# Altium project HAB-Communications-Board.PrjPcb
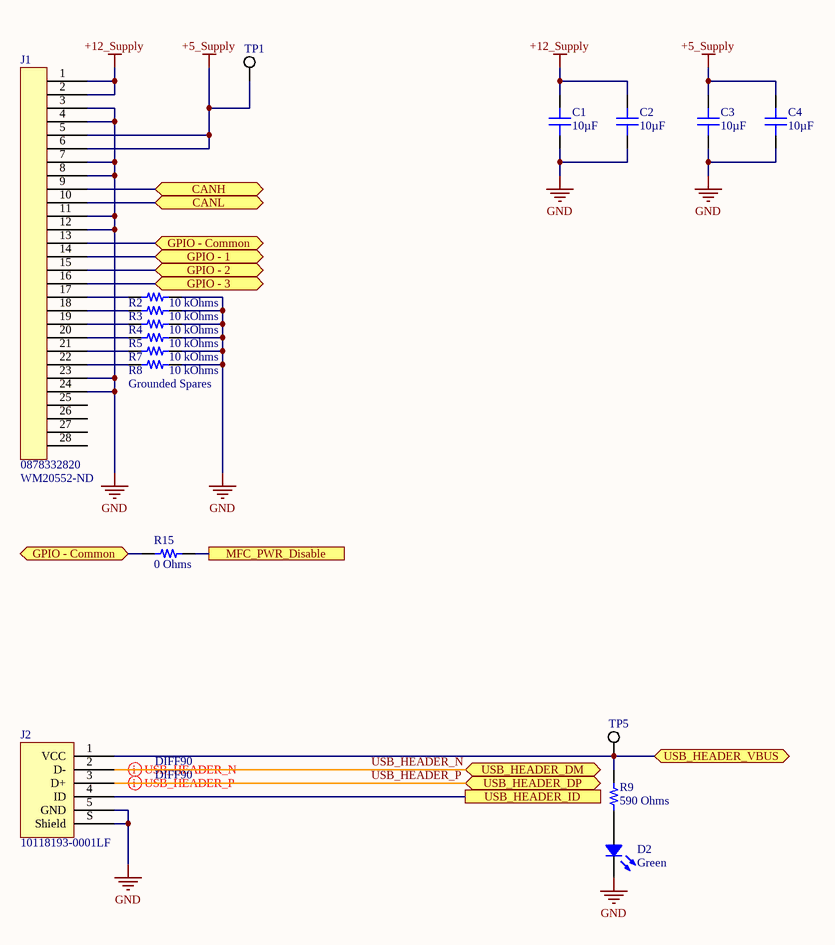
[diagram p0: Interfaces.SchDoc]
5 sheets, 87 parts. Net scope: flat (ports and power ports of the same name join across sheets).
Board file: HAB-Communications-Board.PcbDoc
Sheets:
  Interfaces.SchDoc
  Microcontroller.SchDoc
  Power-Supplies.SchDoc
  Transceivers.SchDoc
  Transmitters.SchDoc

## Sheet Interfaces.SchDoc: Communications Card Interfaces
size A3; Revision: 1A; SheetNumber: 1; SheetTotal: 5; Organization: Brickworks; Address1: Matthew Glazer; Address2: Design Engineer

### Parts
C1  10µF  [CAP 0805_2012]
C2  10µF  [CAP 0805_2012]
C3  10µF  [CAP 0805_2012]
C4  10µF  [CAP 0805_2012]
D2  Green  [LED 0603_1608 GREEN]
J1  0878332820  Supplier Part Number 1: WM20552-ND  [0878332820]
J2  10118193-0001LF  [FCI USB 10118193-0001LF]
R2  10 kOhms  [RES 0603_1608]
R3  10 kOhms  [RES 0603_1608]
R4  10 kOhms  [RES 0603_1608]
R5  10 kOhms  [RES 0603_1608]
R7  10 kOhms  [RES 0603_1608]
R8  10 kOhms  [RES 0603_1608]
R9  590 Ohms  [RES 0603_1608]
R15  0 Ohms  [RES 0603_1608]
TP1  5019  [KSTN-5019_V]  (value not drawn)
TP5  5019  [KSTN-5019_V]  (value not drawn)

### Ports
CANH (bidir), CANL (bidir), GPIO - 1 (bidir), GPIO - 2 (bidir), GPIO - 3 (bidir), GPIO - Common (bidir), MFC_PWR_Disable, USB_HEADER_DM (bidir), USB_HEADER_DP (bidir), USB_HEADER_ID, USB_HEADER_VBUS (bidir)

### Nets
+5_Supply: C3.2 C4.2 J1.5 J1.6 TP1.1
+12_Supply: C1.2 C2.2 J1.1 J1.2
GND: C1.1 C2.1 C3.1 C4.1 D2.2 J1.3 J1.4 J1.7 J1.8 J1.11 J1.12 J1.23 J1.24 J2.5(GND) J2.S(Shield) R2.2 R3.2 R4.2 R5.2 R7.2 R8.2
USB_HEADER_N: J2.2(D-) ; port USB_HEADER_DM
USB_HEADER_P: J2.3(D+) ; port USB_HEADER_DP
NetD2_1: D2.1 R9.1
NetD4_1: J1.10 ; port CANL
NetD4_2: J1.9 ; port CANH
NetJ1_13: J1.13 R15.1 ; port GPIO - Common
NetJ1_14: J1.14 ; port GPIO - 1
NetJ1_15: J1.15 ; port GPIO - 2
NetJ1_16: J1.16 ; port GPIO - 3
NetJ1_17: J1.17 R2.1
NetJ1_18: J1.18 R3.1
NetJ1_19: J1.19 R4.1
NetJ1_20: J1.20 R5.1
NetJ1_21: J1.21 R7.1
NetJ1_22: J1.22 R8.1
NetJ2_1: J2.1(VCC) R9.2 TP5.1 ; port USB_HEADER_VBUS
NetJ2_4: J2.4(ID) ; port USB_HEADER_ID
NetR15_2: R15.2 ; port MFC_PWR_Disable

Not connected (* = marked no-connect by the designer): J1 25 26 27 28

### Layout directives
differential pair; differential pair class DIFF90: USB_HEADER_N, USB_HEADER_P

### Notes on the sheet
- (near R8) Grounded Spares
- Title
- Size:
- Date:
- A3
- Number:
- Time:
- Revision:
- Sheet
- of
- File:

### Library data of the parts
C1-C4 = CC0805KKX5R7BB106: CAP CER 10UF 16V X5R 0805; Manufacturer: Yageo; Tolerance: ±10%; Part Number: CC0805KKX5R7BB106; Value: 10µF; Applications: General Purpose; Capacitance: 10µF; ComponentLink1Description: Datasheet; ComponentLink1URL: https://www.yageo.com/upload/media/product/productsearch/datasheet/mlcc/UPY-GPHC_X5R_4V-to-50V_25.pdf; ComponentLink2Description: DigiKey Link; ComponentLink2URL: http://digikey.com/product-detail/en/yageo/CC0805KKX5R7BB106/311-1865-1-ND/5195767; Device Package: 0805 (2012 Metric); LastUpdated: 9/2/2020 1:04:30 AM; Lifecycle Status: Active; Minimum Order: 1; Mounting Type: Surface Mount, MLCC; Operating Temperature: -55°C ~ 85°C; Package / Case: 0805 (2012 Metric); Packaging: TapeAndReel; PartId: 8867; Part Status: Active; Price: 0.09; Series: CC; Size / Dimension: 0.079" L x 0.049" W (2.00mm x 1.25mm); Supplier 1: DigiKey; Supplier Part Number 1: 311-1865-1-ND; Temperature Coefficient: X5R; Thickness (Max): 0.057" (1.45mm); Voltage - Rated: 16V
D2 = LTST-C193KGKT-5A: LED GREEN CLEAR CHIP SMD; Manufacturer: Lite-On Inc.; Configuration: Standard; Current - Test: 5mA; Lens Color: Colorless; Lens Size: 1.15mm x 0.80mm; Lens Style: Rectangle with Flat Top; Millicandela Rating: 16.25mcd; Viewing Angle: 130°; Voltage - Forward (Vf) (Typ): 2V; Wavelength - Dominant: 572nm; Wavelength - Peak: 574nm; Part Number: LTST-C193KGKT-5A; Color: Green; ComponentLink1Description: Datasheet; ComponentLink1URL: http://optoelectronics.liteon.com/upload/download/DS22-2007-0094/LTST-C193KGKT-5A.PDF; ComponentLink2Description: DigiKey Link; ComponentLink2URL: http://digikey.com/product-detail/en/lite-on-inc/LTST-C193KGKT-5A/160-1828-1-ND/2356247; Device Package: 0603 (1608 Metric); Height (Max): 0.45mm; LastUpdated: 9/2/2020 1:20:41 AM; Lens Transparency: Clear; Lifecycle Status: Active; Minimum Order: 1; Mounting Type: Surface Mount; Package / Case: 0603 (1608 Metric); Packaging: TapeAndReel; PartId: 694; Part Status: Active; Price: 0.06; Series: -; Size / Dimension: 1.60mm L x 0.80mm W; Supplier 1: DigiKey; Supplier Part Number 1: 160-1828-1-ND; Supplier Device Package: Chip LED; Value: Green
J2 = 10118193-0001LF: CONN RCPT USB2.0 MICRO B SMD R/A; Manufacturer: Amphenol ICC (FCI); Connector Type: USB - micro B; Current Rating (Amps): 1.8A per Contact; Gender: Receptacle; Mating Cycles: 10000; Number of Contacts: 5; Number of Ports: 1; Shielding: Shielded; Voltage - Rated: 100VAC; Part Number: 10118193-0001LF; ComponentLink1Description: Datasheet; ComponentLink1URL: https://cdn.amphenol-icc.com/media/wysiwyg/files/documentation/datasheet/inputoutput/io_usb_micro.pdf; ComponentLink2Description: DigiKey Link; ComponentLink2URL: //digikey.com/product-detail/en/amphenol-icc-fci/10118193-0001LF/609-4616-2-ND/2785388; Features: Solder Retention; LastUpdated: 12/9/2019 8:51:28 PM; Lifecycle Status: 0; Minimum Order: 1; Mounting Feature: Horizontal; Mounting Type: Surface Mount, Right Angle; Through Hole; Operating Temperature: -30°C ~ 80°C; Packaging: TapeAndReel; Part Status: Active; Price: 0.21; Series: -; Specifications: USB 2.0; Supplier 1: DigiKey; Supplier Part Number 1: 609-4616-2-ND; Termination: Solder
R2-R5 R7 R8 = RMCF0603JT10K0: RES 10K OHM 5% 1/10W 0603; Manufacturer: Stackpole Electronics Inc; Power (Watts): 0.1W, 1/10W; Temperature Coefficient: ±200ppm/°C; Part Number: RMCF0603JT10K0; Value: 10 kOhms; ComponentLink1Description: Datasheet; ComponentLink1URL: https://www.seielect.com/catalog/sei-packaging.pdf; ComponentLink2Description: DigiKey Link; ComponentLink2URL: http://digikey.com/product-detail/en/stackpole-electronics-inc/RMCF0603JT10K0/RMCF0603JT10K0CT-ND/1943191; Composition: Thick Film; Device Package: 0603 (1608 Metric); Features: Automotive AEC-Q200; Height - Seated (Max): 0.022" (0.55mm); LastUpdated: 8/30/2020 8:48:45 PM; Lifecycle Status: Active; Minimum Order: 1; Number of Terminations: 2; Operating Temperature: -55°C ~ 155°C; Package / Case: 0603 (1608 Metric); Packaging: CutTape; PartId: 25659; Part Status: Active; Price: 0.10; Ratings: AEC-Q200; Resistance: 10 kOhms; Series: RMCF; Size / Dimension: 0.061" L x 0.031" W (1.55mm x 0.80mm); Supplier 1: DigiKey; Supplier Part Number 1: RMCF0603JT10K0CT-ND; Supplier Device Package: 0603; Tolerance: ±5%
R9 = RMCF0603FT590R: RES 590 OHM 1% 1/10W 0603; Manufacturer: Stackpole Electronics Inc; Power (Watts): 0.1W, 1/10W; Temperature Coefficient: ±100ppm/°C; Part Number: RMCF0603FT590R; Value: 590 Ohms; ComponentLink1Description: Datasheet; ComponentLink1URL: https://www.seielect.com/catalog/sei-rmcf_rmcp.pdf; ComponentLink2Description: DigiKey Link; ComponentLink2URL: http://digikey.com/product-detail/en/stackpole-electronics-inc/RMCF0603FT590R/RMCF0603FT590RCT-ND/2418096; Composition: Thick Film; Device Package: 0603 (1608 Metric); Features: Automotive AEC-Q200; Height - Seated (Max): 0.022" (0.55mm); LastUpdated: 9/2/2020 1:09:40 AM; Lifecycle Status: Active; Minimum Order: 1; Number of Terminations: 2; Operating Temperature: -55°C ~ 155°C; Package / Case: 0603 (1608 Metric); Packaging: CutTape; PartId: 23847; Part Status: Active; Price: 0.10; Ratings: AEC-Q200; Resistance: 590 Ohms; Series: RMCF; Size / Dimension: 0.061" L x 0.031" W (1.55mm x 0.80mm); Supplier 1: DigiKey; Supplier Part Number 1: RMCF0603FT590RCT-ND; Supplier Device Package: 0603; Tolerance: ±1%
R15 = RMCF0603ZT0R00: RES 0 OHM JUMPER 1/10W 0603; Manufacturer: Stackpole Electronics Inc; Power (Watts): 0.1W, 1/10W; Part Number: RMCF0603ZT0R00; Value: 0 Ohms; ComponentLink1Description: Datasheet; ComponentLink1URL: https://www.seielect.com/catalog/sei-rmcf_rmcp.pdf; ComponentLink2Description: DigiKey Link; ComponentLink2URL: http://digikey.com/product-detail/en/stackpole-electronics-inc/RMCF0603ZT0R00/RMCF0603ZT0R00CT-ND/1943218; Composition: Thick Film; Device Package: 0603 (1608 Metric); Features: Automotive AEC-Q200; Height - Seated (Max): 0.022" (0.55mm); LastUpdated: 9/2/2020 1:09:45 AM; Lifecycle Status: Active; Minimum Order: 1; Number of Terminations: 2; Operating Temperature: -55°C ~ 155°C; Package / Case: 0603 (1608 Metric); Packaging: CutTape; PartId: 22613; Part Status: Active; Price: 0.10; Ratings: AEC-Q200; Resistance: 0 Ohms; Series: RMCF; Size / Dimension: 0.061" L x 0.031" W (1.55mm x 0.80mm); Supplier 1: DigiKey; Supplier Part Number 1: RMCF0603ZT0R00CT-ND; Supplier Device Package: 0603; Tolerance: Jumper
TP1 TP5 = CMP-1672-00008-1: Test Point, 1 Position SMD, RoHS, Tape and Reel; ComponentLink1Description: Manufacturer URL; Package Quantity: 1000; DatasheetVersion: 03/2014; Packaging: Tape and Reel; ComponentLink2URL: http://www.keyelco.com/product-pdf.cfm?p=1357; ComponentLink1URL: http://www.keyelco.com/; Mount: Surface Mount; Contact Plating: Silver; PackageDescription: 1-Pin Surface Mount Device, Body 3.81 x 2.03 mm; Pins: 1; RoHSCompliant: True; Mounting Technology: Surface Mount; ComponentLink2Description: Datasheet; PackageReference: 5019
J1 = 0878332820: Supplier 1: Digi-Key

## Sheet Microcontroller.SchDoc: Communications Card Microcontroller
size A2; Revision: 1A; SheetNumber: 2; SheetTotal: 5; Organization: Brickworks; Address1: Matthew Glazer; Address2: Design Engineer
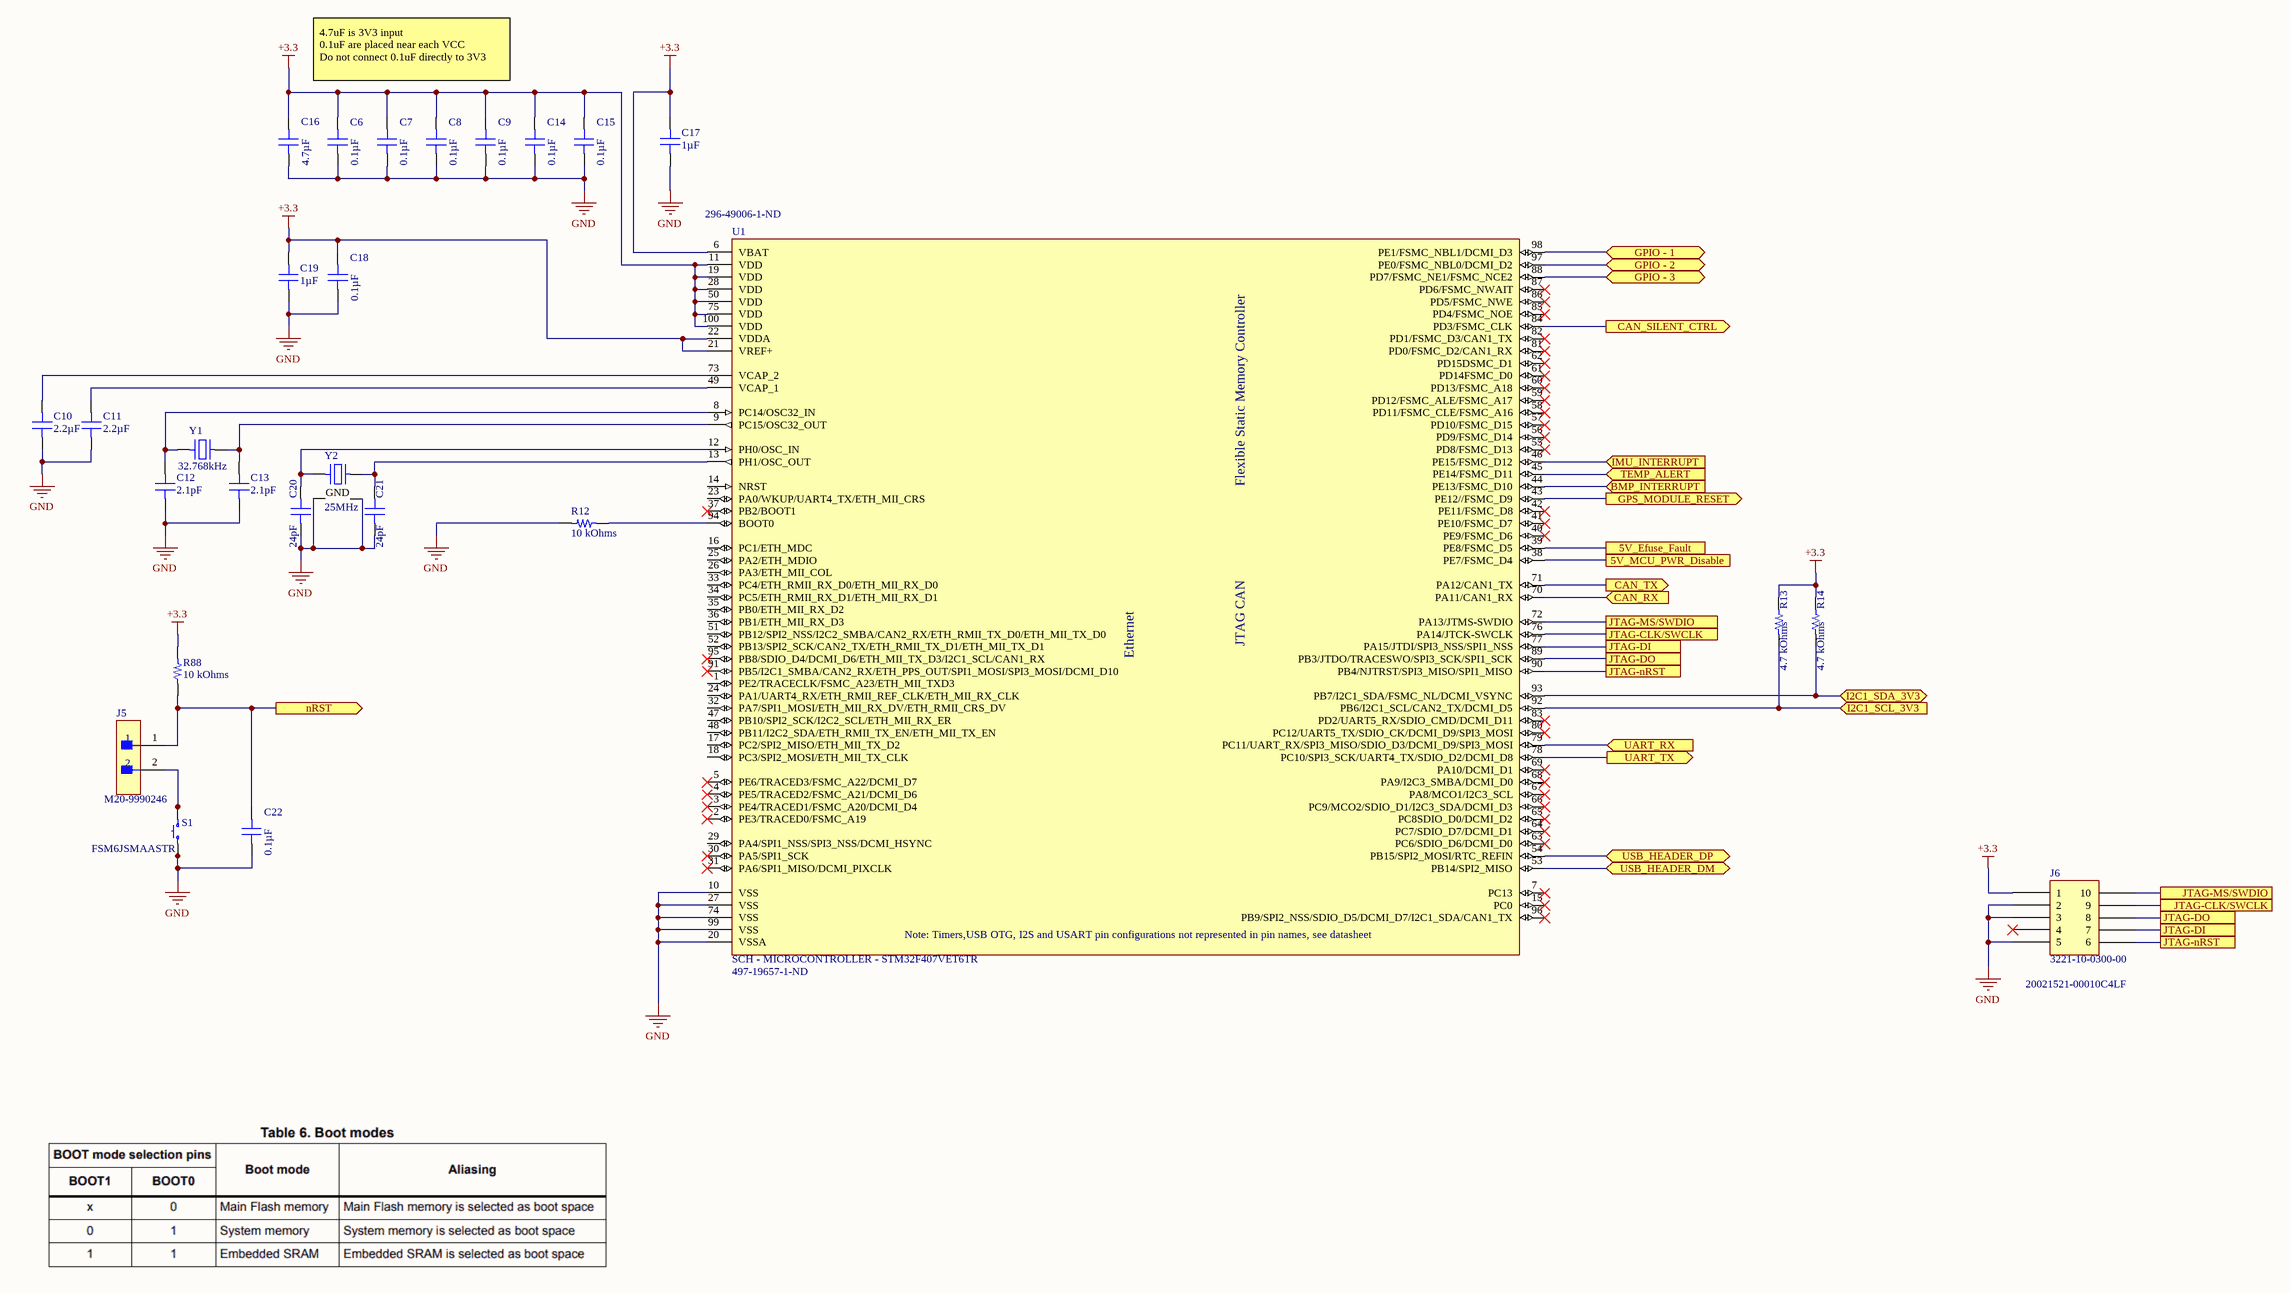
[diagram p1: Microcontroller.SchDoc]

### Parts
C6  0.1µF  [CAP 0603_1608]
C7  0.1µF  [CAP 0603_1608]
C8  0.1µF  [CAP 0603_1608]
C9  0.1µF  [CAP 0603_1608]
C10  2.2µF  [CAP 0603_1608]
C11  2.2µF  [CAP 0603_1608]
C12  2.1pF  [CAP 0603_1608]
C13  2.1pF  [CAP 0603_1608]
C14  0.1µF  [CAP 0603_1608]
C15  0.1µF  [CAP 0603_1608]
C16  4.7µF  [CAP 0603_1608]
C17  1µF  [CAP 0603_1608]
C18  0.1µF  [CAP 0603_1608]
C19  1µF  [CAP 0603_1608]
C20  24pF  [CAP 0603_1608]
C21  24pF  [CAP 0603_1608]
C22  0.1µF  [CAP 0603_1608]
J5  M20-9990246  [FP-M20-9990246-MFG]
J6  3221-10-0300-00  [CNC TECH 3221-10-0300-00]
R12  10 kOhms  [RES 0603_1608]
R13  4.7 kOhms  [RES 0603_1608]
R14  4.7 kOhms  [RES 0603_1608]
R88  10 kOhms  [RES 0603_1608]
S1  FSM6JSMAASTR  [TE FSM6JSMA]
U1  SCH - MICROCONTROLLER - STM32F407VET6TR  Supplier Part Number 1: 497-19657-1-ND  [PCB - LEADLESS - QFP - ST LQFP-100 14X14MM]
Y1  32.768kHz  [ABRACON ABS07]
Y2  25MHz  [EPSON TSX-3225]

### Ports
5V_Efuse_Fault, 5V_MCU_PWR_Disable, BMP_INTERRUPT (in), CAN_RX (in), CAN_SILENT_CTRL (out), CAN_TX (out), GPIO - 1 (bidir), GPIO - 2 (bidir), GPIO - 3 (bidir), GPS_MODULE_RESET (out), I2C1_SCL_3V3 (in), I2C1_SDA_3V3 (bidir), IMU_INTERRUPT (in), JTAG-CLK/SWCLK, JTAG-DI, JTAG-DO, JTAG-MS/SWDIO, JTAG-nRST, nRST (out), TEMP_ALERT (in), UART_RX (in), UART_TX (out), USB_HEADER_DM (bidir), USB_HEADER_DP (bidir)

### Nets
+3.3: C6.2 C7.2 C8.2 C9.2 C14.2 C15.2 C16.2 C17.2 C18.2 C19.2 J6.1 R13.2 R14.2 R88.1 U1.6(VBAT) U1.11(VDD) U1.19(VDD) U1.21(VREF+) U1.22(VDDA) U1.28(VDD) U1.50(VDD) U1.75(VDD) U1.100(VDD)
GND: C6.1 C7.1 C8.1 C9.1 C10.1 C11.1 C12.1 C13.1 C14.1 C15.1 C16.1 C17.1 C18.1 C19.1 C20.1 C21.1 C22.1 J6.2 J6.3 J6.5 R12.2 S1.1 S1.2 U1.10(VSS) U1.20(VSSA) U1.27(VSS) U1.74(VSS) U1.99(VSS) Y2.2(GND) Y2.4(GND)
USB_HEADER_N: U1.53(PB14/SPI2_MISO) ; port USB_HEADER_DM
USB_HEADER_P: U1.54(PB15/SPI2_MOSI/RTC_REFIN) ; port USB_HEADER_DP
NetC10_2: C10.2 U1.73(VCAP_2)
NetC11_2: C11.2 U1.49(VCAP_1)
NetC12_2: C12.2 U1.8(PC14/OSC32_IN) Y1.1
NetC13_2: C13.2 U1.9(PC15/OSC32_OUT) Y1.2
NetC20_2: C20.2 U1.12(PH0/OSC_IN) Y2.1
NetC21_2: C21.2 U1.13(PH1/OSC_OUT) Y2.3
NetC22_2: C22.2 J5.1 R88.2 ; port nRST
NetJ1_14: U1.98(PE1/FSMC_NBL1/DCMI_D3) ; port GPIO - 1
NetJ1_15: U1.97(PE0/FSMC_NBL0/DCMI_D2) ; port GPIO - 2
NetJ1_16: U1.88(PD7/FSMC_NE1/FSMC_NCE2) ; port GPIO - 3
NetJ5_2: J5.2 S1.3 S1.4
NetJ6_6: J6.6 U1.90(PB4/NJTRST/SPI3_MISO/SPI1_MISO) ; port JTAG-nRST
NetJ6_7: J6.7 U1.77(PA15/JTDI/SPI3_NSS/SPI1_NSS) ; port JTAG-DI
NetJ6_8: J6.8 U1.89(PB3/JTDO/TRACESWO/SPI3_SCK/SPI1_SCK) ; port JTAG-DO
NetJ6_9: J6.9 U1.76(PA14/JTCK-SWCLK) ; port JTAG-CLK/SWCLK
NetJ6_10: J6.10 U1.72(PA13/JTMS-SWDIO) ; port JTAG-MS/SWDIO
NetR12_1: R12.1 U1.94(BOOT0)
NetR13_1: R13.1 U1.92(PB6/I2C1_SCL/CAN2_TX/DCMI_D5) ; port I2C1_SCL_3V3
NetR14_1: R14.1 U1.93(PB7/I2C1_SDA/FSMC_NL/DCMI_VSYNC) ; port I2C1_SDA_3V3
NetR54_2: U1.84(PD3/FSMC_CLK) ; port CAN_SILENT_CTRL
NetU1_38: U1.38(PE7/FSMC_D4) ; port 5V_MCU_PWR_Disable
NetU1_39: U1.39(PE8/FSMC_D5) ; port 5V_Efuse_Fault
NetU1_43: U1.43(PE12//FSMC_D9) ; port GPS_MODULE_RESET
NetU1_44: U1.44(PE13/FSMC_D10) ; port BMP_INTERRUPT
NetU1_45: U1.45(PE14/FSMC_D11) ; port TEMP_ALERT
NetU1_46: U1.46(PE15/FSMC_D12) ; port IMU_INTERRUPT
NetU1_70: U1.70(PA11/CAN1_RX) ; port CAN_RX
NetU1_71: U1.71(PA12/CAN1_TX) ; port CAN_TX
NetU1_78: U1.78(PC10/SPI3_SCK/UART4_TX/SDIO_D2/DCMI_D8) ; port UART_TX
NetU1_79: U1.79(PC11/UART_RX/SPI3_MISO/SDIO_D3/DCMI_D9/SPI3_MOSI) ; port UART_RX

Not connected (* = marked no-connect by the designer): J6 4*; U1 1(PE2/TRACECLK/FSMC_A23/ETH_MII_TXD3) 2(PE3/TRACED0/FSMC_A19)* 3(PE4/TRACED1/FSMC_A20/DCMI_D4)* 4(PE5/TRACED2/FSMC_A21/DCMI_D6)* 5(PE6/TRACED3/FSMC_A22/DCMI_D7)* 7(PC13)* 14(NRST) 15(PC0)* 16(PC1/ETH_MDC) 17(PC2/SPI2_MISO/ETH_MII_TX_D2) 18(PC3/SPI2_MOSI/ETH_MII_TX_CLK) 23(PA0/WKUP/UART4_TX/ETH_MII_CRS) 24(PA1/UART4_RX/ETH_RMII_REF_CLK/ETH_MII_RX_CLK) 25(PA2/ETH_MDIO) 26(PA3/ETH_MII_COL) 29(PA4/SPI1_NSS/SPI3_NSS/DCMI_HSYNC) 30(PA5/SPI1_SCK)* 31(PA6/SPI1_MISO/DCMI_PIXCLK)* 32(PA7/SPI1_MOSI/ETH_MII_RX_DV/ETH_RMII_CRS_DV) 33(PC4/ETH_RMII_RX_D0/ETH_MII_RX_D0) 34(PC5/ETH_RMII_RX_D1/ETH_MII_RX_D1) 35(PB0/ETH_MII_RX_D2) 36(PB1/ETH_MII_RX_D3) 37(PB2/BOOT1)* 40(PE9/FSMC_D6)* 41(PE10/FSMC_D7)* 42(PE11/FSMC_D8)* 47(PB10/SPI2_SCK/I2C2_SCL/ETH_MII_RX_ER) 48(PB11/I2C2_SDA/ETH_RMII_TX_EN/ETH_MII_TX_EN) 51(PB12/SPI2_NSS/I2C2_SMBA/CAN2_RX/ETH_RMII_TX_D0/ETH_MII_TX_D0) 52(PB13/SPI2_SCK/CAN2_TX/ETH_RMII_TX_D1/ETH_MII_TX_D1) 55(PD8/FSMC_D13)* 56(PD9/FSMC_D14)* 57(PD10/FSMC_D15)* 58(PD11/FSMC_CLE/FSMC_A16)* 59(PD12/FSMC_ALE/FSMC_A17)* 60(PD13/FSMC_A18)* 61(PD14FSMC_D0)* 62(PD15DSMC_D1)* 63(PC6/SDIO_D6/DCMI_D0)* 64(PC7/SDIO_D7/DCMI_D1)* 65(PC8SDIO_D0/DCMI_D2)* 66(PC9/MCO2/SDIO_D1/I2C3_SDA/DCMI_D3)* 67(PA8/MCO1/I2C3_SCL)* 68(PA9/I2C3_SMBA/DCMI_D0)* 69(PA10/DCMI_D1)* 80(PC12/UART5_TX/SDIO_CK/DCMI_D9/SPI3_MOSI)* 81(PD0/FSMC_D2/CAN1_RX)* 82(PD1/FSMC_D3/CAN1_TX)* 83(PD2/UART5_RX/SDIO_CMD/DCMI_D11)* 85(PD4/FSMC_NOE)* 86(PD5/FSMC_NWE)* 87(PD6/FSMC_NWAIT)* 91(PB5/I2C1_SMBA/CAN2_RX/ETH_PPS_OUT/SPI1_MOSI/SPI3_MOSI/DCMI_D10)* 95(PB8/SDIO_D4/DCMI_D6/ETH_MII_TX_D3/I2C1_SCL/CAN1_RX)* 96(PB9/SPI2_NSS/SDIO_D5/DCMI_D7/I2C1_SDA/CAN1_TX)*

### Notes on the sheet
- 4.7uF is 3V3 input
  0.1uF are placed near each VCC
  Do not connect 0.1uF directly to 3V3
- (near J6) 20021521-00010C4LF
- Title
- Size:
- Date:
- File:
- A2
- Number:
- Time:
- Revision:
- Sheet
- of
- (in symbol SCH - MICROCONTROLLER - STM32F407VET6TR) Flexible Static Memory Controller; CAN; JTAG; Ethernet; Note: Timers,USB OTG, I2S and USART pin configurations not represented in pin names, see datasheet

### Library data of the parts
C6-C9 C14 C15 C18 C22 = CL10B104KA8WPNC: CAP CER 0.1UF 25V X7R 0603; Manufacturer: Samsung Electro-Mechanics; Tolerance: ±10%; Part Number: CL10B104KA8WPNC; Value: 0.1µF; Applications: Automotive; Capacitance: 0.1µF; ComponentLink1Description: Datasheet; ComponentLink1URL: http://www.samsungsem.com/kr/support/product-search/mlcc/CL10B104KA8WPNC.jsp; ComponentLink2Description: DigiKey Link; ComponentLink2URL: http://digikey.com/product-detail/en/samsung-electro-mechanics/CL10B104KA8WPNC/1276-6717-1-ND/5961576; Device Package: 0603 (1608 Metric); Features: Open Mode; LastUpdated: 9/2/2020 1:03:30 AM; Lifecycle Status: Active; Minimum Order: 1; Mounting Type: Surface Mount, MLCC; Operating Temperature: -55°C ~ 125°C; Package / Case: 0603 (1608 Metric); Packaging: TapeAndReel; PartId: 5631; Part Status: Active; Price: 0.02; Ratings: AEC-Q200; Series: CL; Size / Dimension: 0.063" L x 0.031" W (1.60mm x 0.80mm); Supplier 1: DigiKey; Supplier Part Number 1: 1276-6717-1-ND; Temperature Coefficient: X7R; Thickness (Max): 0.035" (0.90mm); Voltage - Rated: 25V
C10 C11 = EMK107BJ225KA-T: CAP CER 2.2UF 16V X5R 0603; Manufacturer: Taiyo Yuden; Tolerance: ±10%; Part Number: EMK107BJ225KA-T; Value: 2.2µF; Applications: General Purpose; Capacitance: 2.2µF; ComponentLink1Description: Datasheet; ComponentLink1URL: https://ds.yuden.co.jp/TYCOMPAS/ut/detail?pn=EMK107BJ225KA-T  &u=M; ComponentLink2Description: DigiKey Link; ComponentLink2URL: http://digikey.com/product-detail/en/taiyo-yuden/EMK107BJ225KA-T/587-1430-1-ND/1004061; Device Package: 0603 (1608 Metric); LastUpdated: 9/2/2020 1:03:30 AM; Lifecycle Status: Active; Minimum Order: 1; Mounting Type: Surface Mount, MLCC; Operating Temperature: -55°C ~ 85°C; Package / Case: 0603 (1608 Metric); Packaging: TapeAndReel; PartId: 5619; Part Status: Active; Price: 0.02; Series: M; Size / Dimension: 0.063" L x 0.031" W (1.60mm x 0.80mm); Supplier 1: DigiKey; Supplier Part Number 1: 587-1430-1-ND; Temperature Coefficient: X5R; Thickness (Max): 0.035" (0.90mm); Voltage - Rated: 16V
C12 C13 = CBR06C219B5GAC: CAP CER RF 2.1PF 50V +/-0.1 PF C; Manufacturer: KEMET; Temperature Coefficient: C0G, NP0; Tolerance: ±0.1pF; Part Number: CBR06C219B5GAC; Value: 2.1pF; Applications: RF, Microwave, High Frequency; Capacitance: 2.1pF; ComponentLink1Description: Datasheet; ComponentLink1URL: https://api.kemet.com/component-edge/download/datasheet/CBR06C219B5GAC.pdf; ComponentLink2Description: DigiKey Link; ComponentLink2URL: http://digikey.com/product-detail/en/kemet/CBR06C219B5GAC/399-16153-1-ND/7649738; Device Package: 0603 (1608 Metric); Features: High Q, Low Loss, Ultra Low ESR; LastUpdated: 9/2/2020 1:03:15 AM; Lifecycle Status: Active; Minimum Order: 1; Mounting Type: Surface Mount, MLCC; Operating Temperature: -55°C ~ 125°C; Package / Case: 0603 (1608 Metric); Packaging: TapeAndReel; PartId: 13663; Part Status: Active; Price: 0.05; Series: CBR-SMD RF C0G; Size / Dimension: 0.063" L x 0.031" W (1.60mm x 0.80mm); Supplier 1: DigiKey; Supplier Part Number 1: 399-16153-1-ND; Thickness (Max): 0.034" (0.87mm); Voltage - Rated: 50V
C16 = C1608X5R1C475K080AC: CAP CER 4.7UF 16V X5R 0603; Manufacturer: TDK Corporation; Tolerance: ±10%; Part Number: C1608X5R1C475K080AC; Value: 4.7µF; Applications: General Purpose; Capacitance: 4.7µF; ComponentLink1Description: Datasheet; ComponentLink1URL: https://product.tdk.com/info/en/catalog/datasheets/mlcc_commercial_general_en.pdf?ref_disty=digikey; ComponentLink2Description: DigiKey Link; ComponentLink2URL: http://digikey.com/product-detail/en/tdk-corporation/C1608X5R1C475K080AC/445-7478-1-ND/2733550; Device Package: 0603 (1608 Metric); Features: Low ESL; LastUpdated: 9/2/2020 1:03:17 AM; Lifecycle Status: Active; Minimum Order: 1; Mounting Type: Surface Mount, MLCC; Operating Temperature: -55°C ~ 85°C; Package / Case: 0603 (1608 Metric); Packaging: TapeAndReel; PartId: 12901; Part Status: Active; Price: 0.06; Series: C; Size / Dimension: 0.063" L x 0.031" W (1.60mm x 0.80mm); Supplier 1: DigiKey; Supplier Part Number 1: 445-7478-1-ND; Temperature Coefficient: X5R; Thickness (Max): 0.035" (0.90mm); Voltage - Rated: 16V
C17 C19 = GCM188R71C105KA64J: CAP CER 1UF 16V X7R 0603; Manufacturer: Murata Electronics; Tolerance: ±10%; Part Number: GCM188R71C105KA64J; Value: 1µF; Applications: Automotive; Capacitance: 1µF; ComponentLink1Description: Datasheet; ComponentLink1URL: https://www.murata.com/~/media/webrenewal/support/library/catalog/products/capacitor/mlcc/c03e.ashx?la=en-us; ComponentLink2Description: DigiKey Link; ComponentLink2URL: http://digikey.com/product-detail/en/murata-electronics/GCM188R71C105KA64J/490-12657-1-ND/5797626; Device Package: 0603 (1608 Metric); LastUpdated: 9/2/2020 1:03:14 AM; Lifecycle Status: Active; Minimum Order: 1; Mounting Type: Surface Mount, MLCC; Operating Temperature: -55°C ~ 125°C; Package / Case: 0603 (1608 Metric); Packaging: TapeAndReel; PartId: 13992; Part Status: Active; Price: 0.03; Ratings: AEC-Q200; Series: GCM; Size / Dimension: 0.063" L x 0.031" W (1.60mm x 0.80mm); Supplier 1: DigiKey; Supplier Part Number 1: 490-12657-1-ND; Temperature Coefficient: X7R; Thickness (Max): 0.035" (0.90mm); Voltage - Rated: 16V
C20 C21 = CL10C240JB8NNNC: CAP CER 24PF 50V C0G/NP0 0603; Manufacturer: Samsung Electro-Mechanics; Temperature Coefficient: C0G, NP0; Tolerance: ±5%; Part Number: CL10C240JB8NNNC; Value: 24pF; Applications: General Purpose; Capacitance: 24pF; ComponentLink1Description: Datasheet; ComponentLink1URL: http://www.samsungsem.com/kr/support/product-search/mlcc/CL10C240JB8NNNC.jsp; ComponentLink2Description: DigiKey Link; ComponentLink2URL: http://digikey.com/product-detail/en/samsung-electro-mechanics/CL10C240JB8NNNC/1276-1761-1-ND/3889847; Device Package: 0603 (1608 Metric); LastUpdated: 9/2/2020 1:03:22 AM; Lifecycle Status: Active; Minimum Order: 1; Mounting Type: Surface Mount, MLCC; Operating Temperature: -55°C ~ 125°C; Package / Case: 0603 (1608 Metric); Packaging: TapeAndReel; PartId: 10003; Part Status: Active; Price: 0.01; Series: CL; Size / Dimension: 0.063" L x 0.031" W (1.60mm x 0.80mm); Supplier 1: DigiKey; Supplier Part Number 1: 1276-1761-1-ND; Thickness (Max): 0.035" (0.90mm); Voltage - Rated: 50V
J5 = CMP-15831-000009-1: CONN HEADER VERT 2POS 2.54MM; Manufacturer: Harwin; Conn Gender: Male; Conn Orientation: Vertical; Number Of Contacts: 2; Current Rating: 3A; ComponentLink2URL: https://cdn.harwin.com/pdfs/M20-999.pdf; ComponentLink2Description: Datasheet; Package: M20-9990246; Temperature: -40°C to +105°C; Octopart: https://octopart.com/m20-9990246-harwin-2590635; Mouser Description: 2.54mm (0.1") Pitch SIL Vertical PC Tail Pin Header, 6.1mm mating pin height, tin, 2 contacts; Temperature Range High: +105°C; Device Class L1: Connectors; RoHS: TRUE; Automotive: No; Height: 8.99mm; Number Of Rows: 1; Contact Material: Tin,Nickel; Category: Conn; Pitch: 2.54mm; Lead Free: Yes; Digikey Description: CONN HEADER VERT 2POS 2.54MM; Manufacturer Part Number: M20-9990246; Temperature Range Low: -40°C; Device Class L3: unset; Device Class L2: Headers and Wire Housings
J6 = 3221-10-0300-00: CONN HEADER SMD 10POS 1.27MM; Manufacturer: CNC Tech; Current Rating (Amps): 1A; Material Flammability Rating: UL94 V-0; Number of Positions: 10; Number of Positions Loaded: All; Pitch - Mating: 0.050" (1.27mm); Shrouding: Shrouded - 4 Wall; Style: Board to Cable/Wire; Part Number: 3221-10-0300-00; ComponentLink1Description: Datasheet; ComponentLink1URL: http://cnctech.us/idcmatching2.pdf; ComponentLink2Description: DigiKey Link; ComponentLink2URL: http://digikey.com/product-detail/en/cnc-tech/3221-10-0300-00/1175-1735-ND/4878946; Connector Type: Header; Contact Finish - Mating: Gold; Contact Finish - Post: Gold; Contact Finish Thickness - Mating: Flash; Contact Material: Brass; Contact Shape: Square; Contact Type: Male Pin; Fastening Type: Push-Pull; Features: Keying Slot; Insulation Height: 0.213" (5.40mm); Insulation Material: Polyamide (PA6T), Nylon 6T; LastUpdated: 1/13/2020 12:09:21 AM; Lifecycle Status: Active; Minimum Order: 1; Mounting Type: Surface Mount; Number of Rows: 2; Operating Temperature: -40°C ~ 105°C; Packaging: Tray; PartId: 109; Part Status: Active; Price: 0.73; Row Spacing - Mating: 0.050" (1.27mm); Series: -; Supplier 1: DigiKey; Supplier Part Number 1: 1175-1735-ND; Termination: Solder
R12 R88 = RMCF0603JT10K0: as R2 on sheet Interfaces; Part Number: RMCF0603JT10K0; Value: 10 kOhms; ComponentLink1Description: Datasheet; ComponentLink1URL: https://www.seielect.com/catalog/sei-packaging.pdf; ComponentLink2Description: DigiKey Link; ComponentLink2URL: http://digikey.com/product-detail/en/stackpole-electronics-inc/RMCF0603JT10K0/RMCF0603JT10K0CT-ND/1943191; Composition: Thick Film; Device Package: 0603 (1608 Metric); Features: Automotive AEC-Q200; Height - Seated (Max): 0.022" (0.55mm); LastUpdated: 8/30/2020 8:48:45 PM; Lifecycle Status: Active; Minimum Order: 1; Number of Terminations: 2; Operating Temperature: -55°C ~ 155°C; Package / Case: 0603 (1608 Metric); Packaging: CutTape; PartId: 25659; Part Status: Active; Price: 0.10; Ratings: AEC-Q200; Resistance: 10 kOhms; Series: RMCF; Size / Dimension: 0.061" L x 0.031" W (1.55mm x 0.80mm); Supplier 1: DigiKey; Supplier Part Number 1: RMCF0603JT10K0CT-ND; Supplier Device Package: 0603; Tolerance: ±5%
R13 R14 = RMCF0603FT4K70: RES 4.7K OHM 1% 1/10W 0603; Manufacturer: Stackpole Electronics Inc; Power (Watts): 0.1W, 1/10W; Temperature Coefficient: ±100ppm/°C; Part Number: RMCF0603FT4K70; Value: 4.7 kOhms; ComponentLink1Description: Datasheet; ComponentLink1URL: https://www.seielect.com/catalog/sei-rmcf_rmcp.pdf; ComponentLink2Description: DigiKey Link; ComponentLink2URL: http://digikey.com/product-detail/en/stackpole-electronics-inc/RMCF0603FT4K70/RMCF0603FT4K70CT-ND/1943033; Composition: Thick Film; Device Package: 0603 (1608 Metric); Features: Automotive AEC-Q200; Height - Seated (Max): 0.022" (0.55mm); LastUpdated: 9/2/2020 1:10:22 AM; Lifecycle Status: Active; Minimum Order: 1; Number of Terminations: 2; Operating Temperature: -55°C ~ 155°C; Package / Case: 0603 (1608 Metric); Packaging: CutTape; PartId: 6078; Part Status: Active; Price: 0.10; Ratings: AEC-Q200; Resistance: 4.7 kOhms; Series: RMCF; Size / Dimension: 0.061" L x 0.031" W (1.55mm x 0.80mm); Supplier 1: DigiKey; Supplier Part Number 1: RMCF0603FT4K70CT-ND; Supplier Device Package: 0603; Tolerance: ±1%
S1 = FSM6JSMAASTR: SWITCH TACTILE SPST-NO 0.05A 24V; Manufacturer: TE Connectivity ALCOSWITCH Switches; Actuator Height off PCB, Vertical: 7.00mm; Actuator Orientation: Top Actuated; Actuator Type: Standard; Contact Rating @ Voltage: 0.05A @ 24VDC; Illumination: Non-Illuminated; Operating Force: 260gf; Outline: 6.00mm x 6.00mm; Switch Function: Off-Mom; Part Number: FSM6JSMAASTR; Circuit: SPST-NO; ComponentLink1Description: Datasheet; ComponentLink1URL: https://www.te.com/commerce/DocumentDelivery/DDEController?Action=srchrtrv&DocNm=1308111-1_SWITCHES_CORE_PROGRAM_CATALOG&DocType=CS&DocLang=English; ComponentLink2Description: DigiKey Link; ComponentLink2URL: http://digikey.com/product-detail/en/te-connectivity-alcoswitch-switches/FSM6JSMAASTR/450-2138-1-ND/5343818; LastUpdated: 9/2/2020 1:27:08 AM; Lifecycle Status: Active; Minimum Order: 1; Mounting Type: Surface Mount; Operating Temperature: -40°C ~ 105°C; Packaging: TapeAndReel; Part Status: Active; Price: 0.37; Series: FSMJSMA; Supplier 1: DigiKey; Supplier Part Number 1: 450-2138-1-ND; Termination Style: Gull Wing
Y1 = ABS07-166-32.768KHZ-T: IOT 32.786KHZ XTAL; Manufacturer: Abracon LLC; ESR (Equivalent Series Resistance): 70 kOhms; Frequency Tolerance: ±10ppm; Load Capacitance: 7pF; Operating Mode: Fundamental; Part Number: ABS07-166-32.768KHZ-T; ComponentLink1Description: Datasheet; ComponentLink1URL: https://abracon.com/datasheets/ABS07-166-32.768kHz-T.pdf; ComponentLink2Description: DigiKey Link; ComponentLink2URL: http://digikey.com/product-detail/en/abracon-llc/ABS07-166-32.768KHZ-T/535-14514-1-ND/8827205; Frequency: 32.768kHz; Height - Seated (Max): 0.035" (0.90mm); LastUpdated: 9/2/2020 1:21:47 AM; Lifecycle Status: Active; Minimum Order: 1; Mounting Type: Surface Mount; Operating Temperature: -40°C ~ 85°C; Package / Case: 2-SMD, No Lead; Packaging: TapeAndReel; PartId: 384; Part Status: Active; Price: 0.35; Series: ABS07; Size / Dimension: 0.126" L x 0.059" W (3.20mm x 1.50mm); Supplier 1: DigiKey; Supplier Part Number 1: 535-14514-1-ND; Type: kHz Crystal (Tuning Fork); Value: 32.768kHz
Y2 = TSX-3225 25.0000MF20P-C0: CRYSTAL 25.0000MHZ 18PF SMD; Manufacturer: EPSON; ESR (Equivalent Series Resistance): 40 Ohms; Frequency Stability: ±20ppm; Frequency Tolerance: ±10ppm; Operating Mode: Fundamental; Part Number: TSX-3225 25.0000MF20P-C0; ComponentLink1Description: Datasheet; ComponentLink1URL: https://support.epson.biz/td/api/doc_check.php?dl=brief_TSX-3225&lang=en; ComponentLink2Description: DigiKey Link; ComponentLink2URL: http://digikey.com/product-detail/en/epson/TSX-3225-25.0000MF20P-C0/SER4212CT-ND/7430967; Frequency: 25MHz; Height - Seated (Max): 0.024" (0.60mm); LastUpdated: 9/2/2020 1:21:54 AM; Lifecycle Status: Active; Load Capacitance: 18pF; Minimum Order: 1; Mounting Type: Surface Mount; Operating Temperature: -20°C ~ 85°C; Package / Case: 4-SMD, No Lead; Packaging: TapeAndReel; PartId: 447; Part Status: Active; Price: 0.18; Series: TSX-3225; Size / Dimension: 0.126" L x 0.098" W (3.20mm x 2.50mm); Supplier 1: DigiKey; Supplier Part Number 1: SER4212CT-ND; Type: MHz Crystal; Value: 25MHz
U1 = SCH - MICROCONTROLLER - STM32F407VET6TR: Supplier 1: Digi-Key

## Sheet Power-Supplies.SchDoc: Communications Card 5V Rail Power Supplies
size A2; Revision: 1A; SheetNumber: 3; SheetTotal: 5; Organization: Brickworks; Address1: Matthew Glazer; Address2: Design Engineer
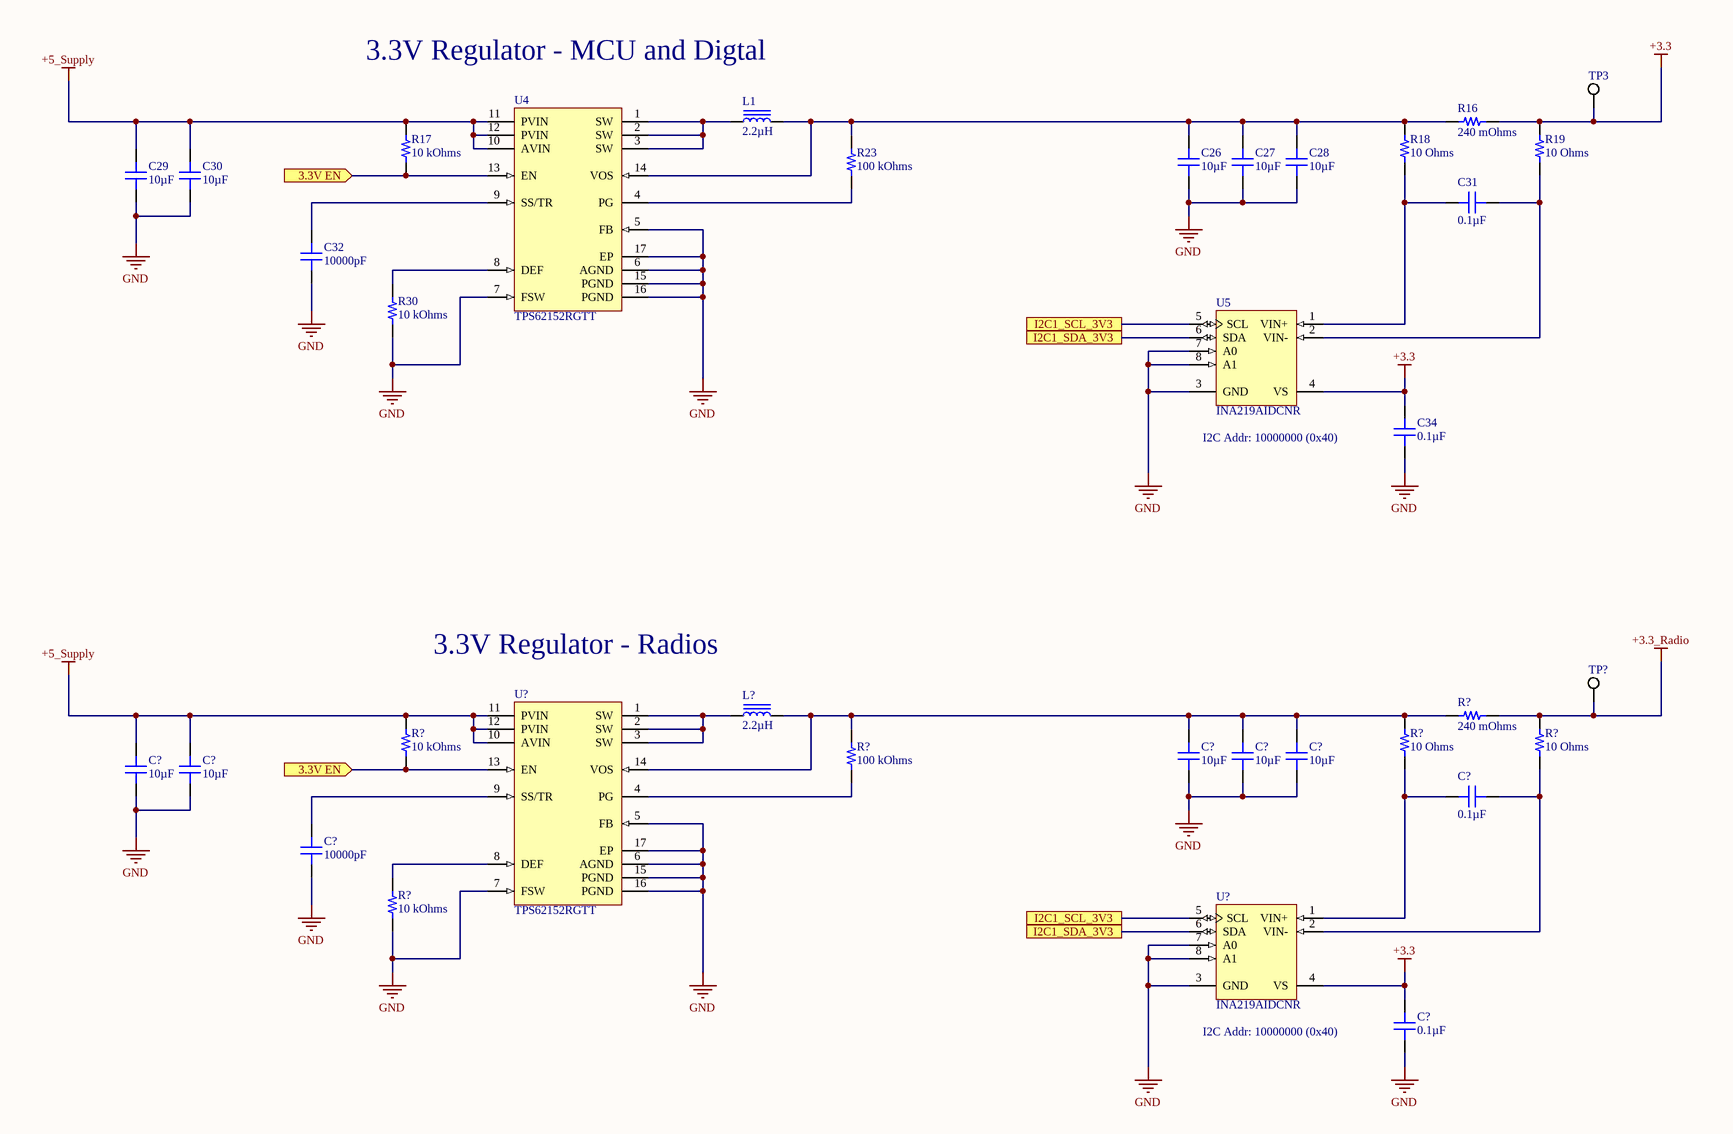
[diagram p2: Power-Supplies.SchDoc]

### Parts
(Parts that share a designator on the sheet are numbered #1, #2 ... from top to bottom, then left to right.)
C26  10µF  [CAP 0805_2012]
C27  10µF  [CAP 0805_2012]
C28  10µF  [CAP 0805_2012]
C29  10µF  [CAP 0805_2012]
C30  10µF  [CAP 0805_2012]
C31  0.1µF  [CAP 0603_1608]
C32  10000pF  [CAP 0603_1608]
C34  0.1µF  [CAP 0603_1608]
C?#1  10µF  [CAP 0805_2012]
C?#2  10µF  [CAP 0805_2012]
C?#3  10µF  [CAP 0805_2012]
C?#4  10µF  [CAP 0805_2012]
C?#5  10µF  [CAP 0805_2012]
C?#6  0.1µF  [CAP 0603_1608]
C?#7  10000pF  [CAP 0603_1608]
C?#8  0.1µF  [CAP 0603_1608]
L1  2.2µH  [BOURNS SRN4018]
L?  2.2µH  [BOURNS SRN4018]
R16  240 mOhms  [RES 0805_2012]
R17  10 kOhms  [RES 0603_1608]
R18  10 Ohms  [RES 0603_1608]
R19  10 Ohms  [RES 0603_1608]
R23  100 kOhms  [RES 0603_1608]
R30  10 kOhms  [RES 0603_1608]
R?#1  240 mOhms  [RES 0805_2012]
R?#2  10 kOhms  [RES 0603_1608]
R?#3  10 Ohms  [RES 0603_1608]
R?#4  10 Ohms  [RES 0603_1608]
R?#5  100 kOhms  [RES 0603_1608]
R?#6  10 kOhms  [RES 0603_1608]
TP3  5019  [KSTN-5019_V]  (value not drawn)
TP?  5019  [KSTN-5019_V]  (value not drawn)
U4  TPS62152RGTT  [RGT0016C_V]
U5  INA219AIDCNR  [DCN0008A_M]
U?#1  TPS62152RGTT  [RGT0016C_V]
U?#2  INA219AIDCNR  [DCN0008A_M]

### Ports
3.3V EN (in), I2C1_SCL_3V3, I2C1_SDA_3V3

### Nets
+3.3: C34.2 C?#8.2 R16.2 R19.2 TP3.1 U5.4(VS) U?#2.4(VS)
+3.3_Radio: R?#1.2 R?#4.2 TP?.1
+5_Supply: C29.2 C30.2 C?#4.2 C?#5.2 R17.2 R?#2.2 U4.10(AVIN) U4.11(PVIN) U4.12(PVIN) U?#1.10(AVIN) U?#1.11(PVIN) U?#1.12(PVIN)
GND: C26.1 C27.1 C28.1 C29.1 C30.1 C32.1 C34.1 C?#1.1 C?#2.1 C?#3.1 C?#4.1 C?#5.1 C?#7.1 C?#8.1 R30.1 R?#6.1 U4.5(FB) U4.6(AGND) U4.7(FSW) U4.15(PGND) U4.16(PGND) U4.17(EP) U5.3(GND) U5.7(A0) U5.8(A1) U?#1.5(FB) U?#1.6(AGND) U?#1.7(FSW) U?#1.15(PGND) U?#1.16(PGND) U?#1.17(EP) U?#2.3(GND) U?#2.7(A0) U?#2.8(A1)
NetC26_2: C26.2 C27.2 C28.2 L1.2 R16.1 R18.2 R23.2 U4.14(VOS)
NetC31_1: C31.1 R19.1 U5.2(VIN-)
NetC31_2: C31.2 R18.1 U5.1(VIN+)
NetC32_2: C32.2 U4.9(SS/TR)
NetC?#1_2: C?#1.2 C?#2.2 C?#3.2 L?.2 R?#1.1 R?#3.2 R?#5.2 U?#1.14(VOS)
NetC?#6_1: C?#6.1 R?#4.1 U?#2.2(VIN-)
NetC?#6_2: C?#6.2 R?#3.1 U?#2.1(VIN+)
NetC?#7_2: C?#7.2 U?#1.9(SS/TR)
NetL1_1: L1.1 U4.1(SW) U4.2(SW) U4.3(SW)
NetL?_1: L?.1 U?#1.1(SW) U?#1.2(SW) U?#1.3(SW)
NetR13_1: U5.5(SCL) U?#2.5(SCL) ; port I2C1_SCL_3V3
NetR14_1: U5.6(SDA) U?#2.6(SDA) ; port I2C1_SDA_3V3
NetR17_1: R17.1 R?#2.1 U4.13(EN) U?#1.13(EN) ; port 3.3V EN
NetR23_1: R23.1 U4.4(PG)
NetR30_2: R30.2 U4.8(DEF)
NetR?#5_1: R?#5.1 U?#1.4(PG)
NetR?#6_2: R?#6.2 U?#1.8(DEF)

### Notes on the sheet
- 3.3V Regulator - MCU and Digtal
- I2C Addr: 10000000 (0x40)
- 3.3V Regulator - Radios
- Title
- Size:
- Date:
- File:
- A2
- Number:
- Time:
- Revision:
- Sheet
- of

### Library data of the parts
C26-C30 C?#1-C?#5 = CC0805KKX5R7BB106: as C1 on sheet Interfaces; Part Number: CC0805KKX5R7BB106; Value: 10µF; Applications: General Purpose; Capacitance: 10µF; ComponentLink1Description: Datasheet; ComponentLink1URL: https://www.yageo.com/upload/media/product/productsearch/datasheet/mlcc/UPY-GPHC_X5R_4V-to-50V_25.pdf; ComponentLink2Description: DigiKey Link; ComponentLink2URL: http://digikey.com/product-detail/en/yageo/CC0805KKX5R7BB106/311-1865-1-ND/5195767; Device Package: 0805 (2012 Metric); LastUpdated: 9/2/2020 1:04:30 AM; Lifecycle Status: Active; Minimum Order: 1; Mounting Type: Surface Mount, MLCC; Operating Temperature: -55°C ~ 85°C; Package / Case: 0805 (2012 Metric); Packaging: TapeAndReel; PartId: 8867; Part Status: Active; Price: 0.09; Series: CC; Size / Dimension: 0.079" L x 0.049" W (2.00mm x 1.25mm); Supplier 1: DigiKey; Supplier Part Number 1: 311-1865-1-ND; Temperature Coefficient: X5R; Thickness (Max): 0.057" (1.45mm); Voltage - Rated: 16V
C31 C34 C?#6 C?#8 = CL10B104KA8WPNC: as C6 on sheet Microcontroller; Part Number: CL10B104KA8WPNC; Value: 0.1µF; Applications: Automotive; Capacitance: 0.1µF; ComponentLink1Description: Datasheet; ComponentLink1URL: http://www.samsungsem.com/kr/support/product-search/mlcc/CL10B104KA8WPNC.jsp; ComponentLink2Description: DigiKey Link; ComponentLink2URL: http://digikey.com/product-detail/en/samsung-electro-mechanics/CL10B104KA8WPNC/1276-6717-1-ND/5961576; Device Package: 0603 (1608 Metric); Features: Open Mode; LastUpdated: 9/2/2020 1:03:30 AM; Lifecycle Status: Active; Minimum Order: 1; Mounting Type: Surface Mount, MLCC; Operating Temperature: -55°C ~ 125°C; Package / Case: 0603 (1608 Metric); Packaging: TapeAndReel; PartId: 5631; Part Status: Active; Price: 0.02; Ratings: AEC-Q200; Series: CL; Size / Dimension: 0.063" L x 0.031" W (1.60mm x 0.80mm); Supplier 1: DigiKey; Supplier Part Number 1: 1276-6717-1-ND; Temperature Coefficient: X7R; Thickness (Max): 0.035" (0.90mm); Voltage - Rated: 25V
C32 C?#7 = C0603S103K4RACTU: CAP CER 10000PF 16V X7R 0603; Manufacturer: KEMET; Tolerance: ±10%; Part Number: C0603S103K4RACTU; Value: 10000pF; Applications: Boardflex Sensitive; Capacitance: 10000pF; ComponentLink1Description: Datasheet; ComponentLink1URL: https://api.kemet.com/component-edge/download/datasheet/C0603S103K4RACTU.pdf; ComponentLink2Description: DigiKey Link; ComponentLink2URL: http://digikey.com/product-detail/en/kemet/C0603S103K4RACTU/399-9135-1-ND/3522653; Device Package: 0603 (1608 Metric); Features: Floating Electrode; LastUpdated: 9/2/2020 1:03:34 AM; Lifecycle Status: Active; Minimum Order: 1; Mounting Type: Surface Mount, MLCC; Operating Temperature: -55°C ~ 125°C; Package / Case: 0603 (1608 Metric); Packaging: TapeAndReel; PartId: 3312; Part Status: Active; Price: 0.07; Series: SMD Comm X7R FE; Size / Dimension: 0.063" L x 0.031" W (1.60mm x 0.80mm); Supplier 1: DigiKey; Supplier Part Number 1: 399-9135-1-ND; Temperature Coefficient: X7R; Thickness (Max): 0.034" (0.87mm); Voltage - Rated: 16V
L1 L? = SRN4018-2R2M: FIXED IND 2.2UH 2.9A 44 MOHM SMD; Manufacturer: Bourns Inc.; Current - Saturation: 3A; DC Resistance (DCR): 44mOhm Max; Frequency - Self Resonant: 60MHz; Inductance Frequency - Test: 100kHz; Material - Core: Ferrite; Q @ Freq: 9 @ 7.96MHz; Shielding: Semi-Shielded; Tolerance: ±20%; Type: Wirewound; Part Number: SRN4018-2R2M; ComponentLink1Description: Datasheet; ComponentLink1URL: https://www.bourns.com/docs/Product-Datasheets/SRN4018.pdf; ComponentLink2Description: DigiKey Link; ComponentLink2URL: http://digikey.com/product-detail/en/bourns-inc/SRN4018-2R2M/SRN4018-2R2MCT-ND/3821517; Current Rating (Amps): 2.9A; Device Package: Nonstandard; Height - Seated (Max): 0.071" (1.80mm); Inductance: 2.2µH; LastUpdated: 9/2/2020 1:30:23 AM; Lifecycle Status: Active; Minimum Order: 1; Mounting Type: Surface Mount; Operating Temperature: -40°C ~ 125°C; Package / Case: Nonstandard; Packaging: TapeAndReel; PartId: 3660; Part Status: Active; Price: 0.16; Series: SRN4018; Size / Dimension: 0.157" L x 0.157" W (4.00mm x 4.00mm); Supplier 1: DigiKey; Supplier Part Number 1: SRN4018-2R2MCT-ND; Value: 2.2µH
R16 R?#1 = ERJ-6DQFR24V: RES 0.24 OHM 1% 1/2W 0805; Manufacturer: Panasonic Electronic Components; Power (Watts): 0.5W, 1/2W; Temperature Coefficient: ±100ppm/°C; Part Number: ERJ-6DQFR24V; Value: 240 mOhms; ComponentLink1Description: Datasheet; ComponentLink1URL: https://industrial.panasonic.com/cdbs/www-data/pdf/RDN0000/AOA0000C313.pdf; ComponentLink2Description: DigiKey Link; ComponentLink2URL: http://digikey.com/product-detail/en/panasonic-electronic-components/ERJ-6DQFR24V/P19293CT-ND/6004648; Composition: Thick Film; Device Package: 0805 (2012 Metric); Features: Automotive AEC-Q200, Current Sense; Height - Seated (Max): 0.028" (0.70mm); LastUpdated: 9/2/2020 1:14:59 AM; Lifecycle Status: Active; Minimum Order: 1; Number of Terminations: 2; Operating Temperature: -55°C ~ 155°C; Package / Case: 0805 (2012 Metric); Packaging: TapeAndReel; PartId: 39224; Part Status: Active; Price: 0.04; Ratings: AEC-Q200; Resistance: 240 mOhms; Series: ERJ; Size / Dimension: 0.079" L x 0.049" W (2.00mm x 1.25mm); Supplier 1: DigiKey; Supplier Part Number 1: P19293CT-ND; Supplier Device Package: 0805; Tolerance: ±1%
R17 R30 R?#2 R?#6 = RMCF0603JT10K0: as R2 on sheet Interfaces; Part Number: RMCF0603JT10K0; Value: 10 kOhms; ComponentLink1Description: Datasheet; ComponentLink1URL: https://www.seielect.com/catalog/sei-packaging.pdf; ComponentLink2Description: DigiKey Link; ComponentLink2URL: http://digikey.com/product-detail/en/stackpole-electronics-inc/RMCF0603JT10K0/RMCF0603JT10K0CT-ND/1943191; Composition: Thick Film; Device Package: 0603 (1608 Metric); Features: Automotive AEC-Q200; Height - Seated (Max): 0.022" (0.55mm); LastUpdated: 8/30/2020 8:48:45 PM; Lifecycle Status: Active; Minimum Order: 1; Number of Terminations: 2; Operating Temperature: -55°C ~ 155°C; Package / Case: 0603 (1608 Metric); Packaging: CutTape; PartId: 25659; Part Status: Active; Price: 0.10; Ratings: AEC-Q200; Resistance: 10 kOhms; Series: RMCF; Size / Dimension: 0.061" L x 0.031" W (1.55mm x 0.80mm); Supplier 1: DigiKey; Supplier Part Number 1: RMCF0603JT10K0CT-ND; Supplier Device Package: 0603; Tolerance: ±5%
R18 R19 R?#3 R?#4 = CRGCQ0603F10R: CRGCQ 0603 10R 1%; Manufacturer: TE Connectivity Passive Product; Power (Watts): 0.1W, 1/10W; Temperature Coefficient: ±400ppm/°C; Part Number: CRGCQ0603F10R; Value: 10 Ohms; ComponentLink1Description: Datasheet; ComponentLink1URL: https://www.te.com/commerce/DocumentDelivery/DDEController?Action=srchrtrv&DocNm=1773204-3&DocType=DS&DocLang=English; ComponentLink2Description: DigiKey Link; ComponentLink2URL: http://digikey.com/product-detail/en/te-connectivity-passive-product/CRGCQ0603F10R/A129664CT-ND/8577496; Composition: Thick Film; Device Package: 0603 (1608 Metric); Features: Automotive AEC-Q200, Moisture Resistant; Height - Seated (Max): 0.022" (0.55mm); LastUpdated: 9/2/2020 1:09:39 AM; Lifecycle Status: Active; Minimum Order: 1; Number of Terminations: 2; Operating Temperature: -55°C ~ 155°C; Package / Case: 0603 (1608 Metric); Packaging: CutTape; PartId: 23975; Part Status: Active; Price: 0.10; Ratings: AEC-Q200; Resistance: 10 Ohms; Series: CRGCQ; Size / Dimension: 0.063" L x 0.031" W (1.60mm x 0.80mm); Supplier 1: DigiKey; Supplier Part Number 1: A129664CT-ND; Supplier Device Package: 0603; Tolerance: ±1%
R23 R?#5 = RC0603JR-10100KL: RES SMD 100K OHM 5% 1/10W 0603; Manufacturer: Yageo; Power (Watts): 0.1W, 1/10W; Temperature Coefficient: ±100ppm/°C; Part Number: RC0603JR-10100KL; Value: 100 kOhms; ComponentLink1Description: Datasheet; ComponentLink1URL: https://www.yageo.com/upload/media/product/productsearch/datasheet/rchip/PYu-RC_Group_51_RoHS_L_10.pdf; ComponentLink2Description: DigiKey Link; ComponentLink2URL: http://digikey.com/product-detail/en/yageo/RC0603JR-10100KL/YAG2294CT-ND/5252408; Composition: Thick Film; Device Package: 0603 (1608 Metric); Features: Moisture Resistant; Height - Seated (Max): 0.022" (0.55mm); LastUpdated: 9/2/2020 1:10:22 AM; Lifecycle Status: Active; Minimum Order: 1; Number of Terminations: 2; Operating Temperature: -55°C ~ 155°C; Package / Case: 0603 (1608 Metric); Packaging: CutTape; PartId: 6071; Part Status: Active; Price: 0.10; Resistance: 100 kOhms; Series: RC; Size / Dimension: 0.063" L x 0.031" W (1.60mm x 0.80mm); Supplier 1: DigiKey; Supplier Part Number 1: YAG2294CT-ND; Supplier Device Package: 0603; Tolerance: ±5%
TP3 TP? = CMP-1672-00008-1: as TP1 on sheet Interfaces; ComponentLink1Description: Manufacturer URL; Package Quantity: 1000; DatasheetVersion: 03/2014; Packaging: Tape and Reel; ComponentLink2URL: http://www.keyelco.com/product-pdf.cfm?p=1357; ComponentLink1URL: http://www.keyelco.com/; Mount: Surface Mount; Contact Plating: Silver; PackageDescription: 1-Pin Surface Mount Device, Body 3.81 x 2.03 mm; Pins: 1; RoHSCompliant: True; Mounting Technology: Surface Mount; ComponentLink2Description: Datasheet; PackageReference: 5019
U4 U?#1 = CMP-0323-00129-3: Buck Step Down Regulator with 3 to 17 V Input and 3.3 V Output, -40 to 85 degC, 16-Pin QFN (RGT), Green (RoHS & no Sb/Br); Manufacturer: Texas Instruments; Rating: Catalog; Duty Cycle(Max)(%): 100; Regulated Outputs(#): 1; Preset Vout(V): 3.3; Vin(Max)(V): 17; Switch Current Limit(Typ)(A): 1.7; SubFamily: Step-Down Regulator; Iq(Typ)(mA): 0.017; Vin(Min)(V): 3; Synchronous Rectification: TRUE; PackageVersion: revH, Oct-2011; ComponentLink2Description: Package Specification; Code_JEDEC: MO-220; ComponentLink1Description: Datasheet; PackageDescription: 16-Pin Plastic Quad Flat No-Lead, 3 x 3 mm Body, 0.5 mm Pitch, 1.7 x 1.7 mm Exposed Pad; Iout(Max)(A): 1; Eco-Plan: Green (RoHS & no Sb/Br); PartNumber: TPS62152RGTT; Vout(Max)(V): 3.3; Topology: Buck; ComponentLink3URL: Samples URL:http://www.ti.com/product/tps54611#samples; ComponentLink2URL: http://www.ti.com/litv/pdf/mpqf119g; ComponentLink3Description: URL Link1; ComponentLink1URL: http://www.ti.com/general/docs/lit/getliterature.tsp?genericPartNumber=TPS62152&fileType=pdf; Vout(Min)(V): 3.3; Mounting Technology: Surface Mount; DatasheetVersion: SLVSAL5; PackageReference: RGT0016C
U5 U?#2 = CMP-0704-00041-2: Zero-Drift, Bi-directional Current / Power Monitor, 3 to 5.5 V, -40 to 125 degC, 8-pin SOP (DCN8), Green (RoHS & no Sb/Br); Manufacturer: Texas Instruments; Input Offset (+/-)(Max)(uV): 100; Small-Signal Bandwidth(Typ)(MHz): 0.011; SubFamily: Current Shunt Monitor; Rating: Catalog; Quiescent Current (+/-)(Typ)(mA): 0.7; Vs(Max)(V): 5.5; Common Mode Range(Min)(V): 0; Vs(Min)(V): 3; Common Mode Range(Max)(V): 26; Gain(V/V): 1, 0.5, 0.25, 0.125; ComponentLink3URL: http://www.ti.com/lit/ml/mpds099c/mpds099c.pdf; ComponentLink2URL: http://www.ti.com/general/docs/lit/getliterature.tsp?genericPartNumber=INA219&fileType=pdf; PackageReference: DCN0008A; ComponentLink1URL: http://www.ti.com/; ComponentLink1Description: Manufacturer URL; Code_JEDEC: MO-178; CMRR(Min)(dB): 100; DatasheetVersion: SBOS448F; Mounting Technology: Surface Mount; ComponentLink3Description: Package Specification; PartNumber: INA219AIDCNR; PackageVersion: 4202106/D, 11/2009; Eco-Plan: Green (RoHS & no Sb/Br); ComponentLink2Description: Datasheet; PackageDescription: 8-Pin Plastic Small Outline, Body 1.6 x 2.9 mm, Pitch 0.65 mm

## Sheet Transceivers.SchDoc: Communications Card Transceivers
size A3; Revision: 1A; SheetNumber: 4; SheetTotal: 4; Organization: Brickworks; Address1: Matthew Glazer; Address2: Design Engineer
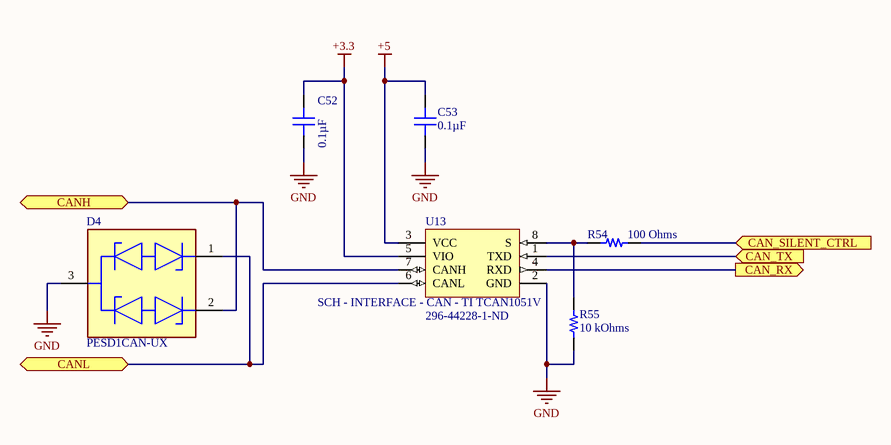
[diagram p3: Transceivers.SchDoc]

### Parts
C52  0.1µF  [CAP 0603_1608]
C53  0.1µF  [CAP 0603_1608]
D4  PESD1CAN-UX  [FP-SOT323-MFG]
R54  100 Ohms  [RES 0603_1608]
R55  10 kOhms  [RES 0603_1608]
U13  SCH - INTERFACE - CAN - TI TCAN1051V  Supplier Part Number 1: 296-44228-1-ND  [PCB - LEADS - SOIC - TI SOIC-8]

### Ports
CAN_RX (out), CAN_SILENT_CTRL (in), CAN_TX (in), CANH (bidir), CANL (bidir)

### Nets
+3.3: C52.2 U13.5(VIO)
+5: C53.2 U13.3(VCC)
GND: C52.1 C53.1 D4.3(common_cathode) R55.1 U13.2(GND)
NetD4_1: D4.1(cathode_1) U13.6(CANL) ; port CANL
NetD4_2: D4.2(cathode_2) U13.7(CANH) ; port CANH
NetR54_1: R54.1 R55.2 U13.8(S)
NetR54_2: R54.2 ; port CAN_SILENT_CTRL
NetU1_70: U13.4(RXD) ; port CAN_RX
NetU1_71: U13.1(TXD) ; port CAN_TX

### Notes on the sheet
- Title
- Size:
- Date:
- A3
- Number:
- Time:
- Revision:
- Sheet
- of
- File:

### Library data of the parts
C52 C53 = CL10B104KA8WPNC: as C6 on sheet Microcontroller; Part Number: CL10B104KA8WPNC; Value: 0.1µF; Applications: Automotive; Capacitance: 0.1µF; ComponentLink1Description: Datasheet; ComponentLink1URL: http://www.samsungsem.com/kr/support/product-search/mlcc/CL10B104KA8WPNC.jsp; ComponentLink2Description: DigiKey Link; ComponentLink2URL: http://digikey.com/product-detail/en/samsung-electro-mechanics/CL10B104KA8WPNC/1276-6717-1-ND/5961576; Device Package: 0603 (1608 Metric); Features: Open Mode; LastUpdated: 9/2/2020 1:03:30 AM; Lifecycle Status: Active; Minimum Order: 1; Mounting Type: Surface Mount, MLCC; Operating Temperature: -55°C ~ 125°C; Package / Case: 0603 (1608 Metric); Packaging: TapeAndReel; PartId: 5631; Part Status: Active; Price: 0.02; Ratings: AEC-Q200; Series: CL; Size / Dimension: 0.063" L x 0.031" W (1.60mm x 0.80mm); Supplier 1: DigiKey; Supplier Part Number 1: 1276-6717-1-ND; Temperature Coefficient: X7R; Thickness (Max): 0.035" (0.90mm); Voltage - Rated: 25V
D4 = CMP-14436-000006-1: TVS DIODE 24V 50V SC70-3
R54 = RMCF0603FG100R: RES 100 OHM 1% 1/10W 0603; Manufacturer: Stackpole Electronics Inc; Power (Watts): 0.1W, 1/10W; Temperature Coefficient: ±100ppm/°C; Part Number: RMCF0603FG100R; Value: 100 Ohms; ComponentLink1Description: Datasheet; ComponentLink1URL: https://www.seielect.com/catalog/sei-rmcf_rmcp.pdf; ComponentLink2Description: DigiKey Link; ComponentLink2URL: http://digikey.com/product-detail/en/stackpole-electronics-inc/RMCF0603FG100R/RMCF0603FG100RCT-ND/4425033; Composition: Thick Film; Device Package: 0603 (1608 Metric); Features: Automotive AEC-Q200; Height - Seated (Max): 0.022" (0.55mm); LastUpdated: 9/2/2020 1:09:39 AM; Lifecycle Status: Active; Minimum Order: 1; Number of Terminations: 2; Operating Temperature: -55°C ~ 155°C; Package / Case: 0603 (1608 Metric); Packaging: CutTape; PartId: 24036; Part Status: Active; Price: 0.10; Ratings: AEC-Q200; Resistance: 100 Ohms; Series: RMCF; Size / Dimension: 0.061" L x 0.031" W (1.55mm x 0.80mm); Supplier 1: DigiKey; Supplier Part Number 1: RMCF0603FG100RCT-ND; Supplier Device Package: 0603; Tolerance: ±1%
R55 = RMCF0603JT10K0: as R2 on sheet Interfaces; Part Number: RMCF0603JT10K0; Value: 10 kOhms; ComponentLink1Description: Datasheet; ComponentLink1URL: https://www.seielect.com/catalog/sei-packaging.pdf; ComponentLink2Description: DigiKey Link; ComponentLink2URL: http://digikey.com/product-detail/en/stackpole-electronics-inc/RMCF0603JT10K0/RMCF0603JT10K0CT-ND/1943191; Composition: Thick Film; Device Package: 0603 (1608 Metric); Features: Automotive AEC-Q200; Height - Seated (Max): 0.022" (0.55mm); LastUpdated: 8/30/2020 8:48:45 PM; Lifecycle Status: Active; Minimum Order: 1; Number of Terminations: 2; Operating Temperature: -55°C ~ 155°C; Package / Case: 0603 (1608 Metric); Packaging: CutTape; PartId: 25659; Part Status: Active; Price: 0.10; Ratings: AEC-Q200; Resistance: 10 kOhms; Series: RMCF; Size / Dimension: 0.061" L x 0.031" W (1.55mm x 0.80mm); Supplier 1: DigiKey; Supplier Part Number 1: RMCF0603JT10K0CT-ND; Supplier Device Package: 0603; Tolerance: ±5%
U13 = SCH - INTERFACE - CAN - TI TCAN1051V: Supplier 1: Digi-Key

## Sheet Transmitters.SchDoc: Communications Card Interfaces
size A3; Revision: 1A; SheetNumber: 5; SheetTotal: 5; Organization: Brickworks; Address1: Matthew Glazer; Address2: Design Engineer
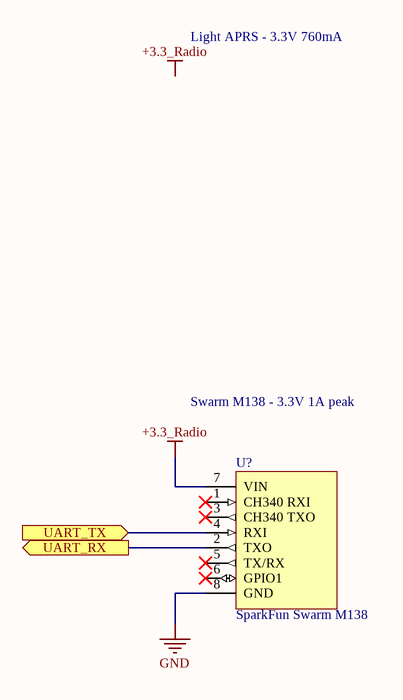
[diagram p4: Transmitters.SchDoc]

### Parts
(Parts that share a designator on the sheet are numbered #1, #2 ... from top to bottom, then left to right.)
U?#3  SparkFun Swarm M138  [SWARM_M138]

### Ports
UART_RX (out), UART_TX (in)

### Nets
+3.3_Radio: U?#3.7(VIN)
GND: U?#3.8(GND)
NetU1_78: U?#3.4(RXI) ; port UART_TX
NetU1_79: U?#3.2(TXO) ; port UART_RX

Not connected (* = marked no-connect by the designer): U?#3 1(CH340_RXI)* 3(CH340_TXO)* 5(TX/RX)* 6(GPIO1)*

### Notes on the sheet
- Light APRS - 3.3V 760mA
- Swarm M138 - 3.3V 1A peak
- Labels drawn without touching a wire or pin: +3.3_Radio
- Title
- Size:
- Date:
- A3
- Number:
- Time:
- Revision:
- Sheet
- of
- File:

## Nets that join several sheets
+3.3: Microcontroller (23 pins), Power-Supplies (7 pins), Transceivers (C52.2 U13.5)
+3.3_Radio: Power-Supplies (R?#1.2 R?#4.2 TP?.1), Transmitters (U?#3.7)
+5_Supply: Interfaces (5 pins), Power-Supplies (12 pins)
GND: Interfaces (21 pins), Microcontroller (30 pins), Power-Supplies (34 pins), Transceivers (5 pins), Transmitters (U?#3.8)
NetD4_1: Interfaces (J1.10), Transceivers (D4.1 U13.6)
NetD4_2: Interfaces (J1.9), Transceivers (D4.2 U13.7)
NetJ1_14: Interfaces (J1.14), Microcontroller (U1.98)
NetJ1_15: Interfaces (J1.15), Microcontroller (U1.97)
NetJ1_16: Interfaces (J1.16), Microcontroller (U1.88)
NetR13_1: Microcontroller (R13.1 U1.92), Power-Supplies (U5.5 U?#2.5)
NetR14_1: Microcontroller (R14.1 U1.93), Power-Supplies (U5.6 U?#2.6)
NetR54_2: Microcontroller (U1.84), Transceivers (R54.2)
NetU1_70: Microcontroller (U1.70), Transceivers (U13.4)
NetU1_71: Microcontroller (U1.71), Transceivers (U13.1)
NetU1_78: Microcontroller (U1.78), Transmitters (U?#3.4)
NetU1_79: Microcontroller (U1.79), Transmitters (U?#3.2)
USB_HEADER_N: Interfaces (J2.2), Microcontroller (U1.53)
USB_HEADER_P: Interfaces (J2.3), Microcontroller (U1.54)